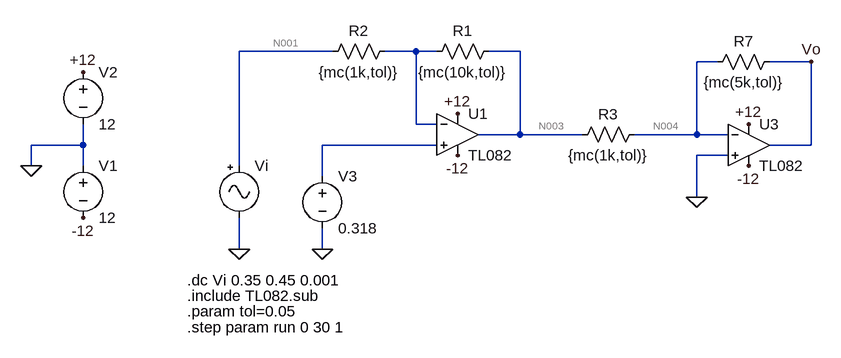
[diagram p0: schematic EJ_6_Aplicacion.asc]
EJ_6_Aplicacion.asc, the LTspice schematic file:
Version 4
SHEET 1 1368 740
WIRE 112 48 -32 48
WIRE 240 48 192 48
WIRE 272 48 240 48
WIRE 400 48 352 48
WIRE 704 64 672 64
WIRE 848 64 784 64
WIRE 240 160 240 48
WIRE 272 160 240 160
WIRE 400 176 400 48
WIRE 400 176 336 176
WIRE 496 176 400 176
WIRE 672 176 672 64
WIRE 672 176 576 176
WIRE 720 176 672 176
WIRE -272 192 -272 160
WIRE -272 192 -352 192
WIRE 272 192 96 192
WIRE 848 192 848 64
WIRE 848 192 784 192
WIRE 720 208 672 208
WIRE -352 224 -352 192
WIRE -272 224 -272 192
WIRE -32 224 -32 48
WIRE 96 240 96 192
WIRE 672 272 672 208
WIRE -32 352 -32 304
WIRE 96 352 96 320
FLAG -352 224 0
FLAG -272 80 +12
FLAG 304 144 +12
FLAG -272 304 -12
FLAG 304 208 -12
FLAG -32 352 0
FLAG 752 160 +12
FLAG 752 224 -12
FLAG 848 64 Vo
FLAG 96 352 0
FLAG 672 272 0
SYMBOL Opamps\\opamp2 304 112 R0
SYMATTR InstName U1
SYMATTR Value TL082
SYMBOL voltage -272 208 R0
WINDOW 123 0 0 Left 2
WINDOW 39 0 0 Left 2
SYMATTR InstName V1
SYMATTR Value 12
SYMBOL voltage -272 64 R0
WINDOW 123 0 0 Left 2
WINDOW 39 0 0 Left 2
SYMATTR InstName V2
SYMATTR Value 12
SYMBOL Misc\\signal -32 208 R0
WINDOW 123 0 0 Left 2
WINDOW 39 0 0 Left 2
SYMATTR InstName Vi
SYMATTR Value ""
SYMBOL res 368 32 R90
WINDOW 0 0 56 VBottom 2
WINDOW 3 32 56 VTop 2
SYMATTR InstName R1
SYMATTR Value {mc(10k,tol)}
SYMBOL Opamps\\opamp2 752 128 R0
SYMATTR InstName U3
SYMATTR Value TL082
SYMBOL res 800 48 R90
WINDOW 0 0 56 VBottom 2
WINDOW 3 32 56 VTop 2
SYMATTR InstName R7
SYMATTR Value {mc(5k,tol)}
SYMBOL res 208 32 R90
WINDOW 0 0 56 VBottom 2
WINDOW 3 32 56 VTop 2
SYMATTR InstName R2
SYMATTR Value {mc(1k,tol)}
SYMBOL res 592 160 R90
WINDOW 0 0 56 VBottom 2
WINDOW 3 32 56 VTop 2
SYMATTR InstName R3
SYMATTR Value {mc(1k,tol)}
SYMBOL voltage 96 224 R0
WINDOW 123 0 0 Left 2
WINDOW 39 0 0 Left 2
SYMATTR InstName V3
SYMATTR Value 0.318
TEXT -112 400 Left 2 !.dc Vi 0.35 0.45 0.001
TEXT -112 424 Left 2 !.include TL082.sub
TEXT -112 448 Left 2 !.param tol=0.05
TEXT -112 472 Left 2 !.step param run 0 30 1

The netlist it stands for:
* EJ_6_Aplicacion.asc
XU1 N005 N002 +12 -12 N003 TL082  ; pins In+ In- V+ V- OUT
V1 0 -12 12
V2 +12 0 12
Vi N001 0
R1 N003 N002 {mc(10k,tol)}
XU3 0 N004 +12 -12 Vo TL082  ; pins In+ In- V+ V- OUT
R7 Vo N004 {mc(5k,tol)}
R2 N002 N001 {mc(1k,tol)}
R3 N004 N003 {mc(1k,tol)}
V3 N005 0 0.318
.dc Vi 0.35 0.45 0.001
.include TL082.sub
.param tol=0.05
.step param run 0 30 1
.backanno
.end

* Results of the author's LTspice run, read from the files saved beside the schematic
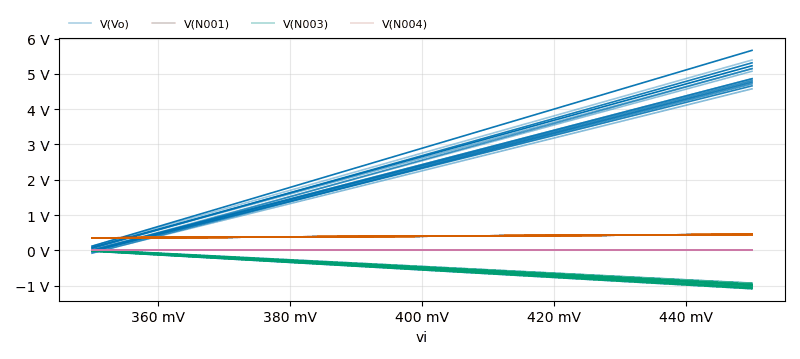
[diagram p1: DC transfer characteristic of EJ_6_Aplicacion.asc, plotted from the saved traces]
* DC transfer characteristic, 31 runs:
*   V(Vo) [run 1]: -21.24 mV at vi=350 mV, 4.763 V at vi=450 mV, min -21.24 mV, max 4.763 V
*   V(Vo) [run 2]: 115.9 mV at vi=350 mV, 5.393 V at vi=450 mV, min 115.9 mV, max 5.393 V
*   V(Vo) [run 3]: 680.2 µV at vi=350 mV, 5.073 V at vi=450 mV, min 680.2 µV, max 5.073 V
*   V(Vo) [run 4]: -72.02 mV at vi=350 mV, 4.576 V at vi=450 mV, min -72.02 mV, max 4.576 V
*   V(Vo) [run 5]: 73.93 mV at vi=350 mV, 5.148 V at vi=450 mV, min 73.93 mV, max 5.148 V
*   V(Vo) [run 6]: -2.247 mV at vi=350 mV, 4.864 V at vi=450 mV, min -2.247 mV, max 4.864 V
*   V(Vo) [run 7]: 21.39 mV at vi=350 mV, 4.752 V at vi=450 mV, min 21.39 mV, max 4.752 V
*   V(Vo) [run 8]: -81.12 mV at vi=350 mV, 4.777 V at vi=450 mV, min -81.12 mV, max 4.777 V
*   V(N001) [run 1]: 350 mV at vi=350 mV, 450 mV at vi=450 mV, min 350 mV, max 450 mV
*   V(N001) [run 2]: 350 mV at vi=350 mV, 450 mV at vi=450 mV, min 350 mV, max 450 mV
*   V(N001) [run 3]: 350 mV at vi=350 mV, 450 mV at vi=450 mV, min 350 mV, max 450 mV
*   V(N001) [run 4]: 350 mV at vi=350 mV, 450 mV at vi=450 mV, min 350 mV, max 450 mV
*   V(N001) [run 5]: 350 mV at vi=350 mV, 450 mV at vi=450 mV, min 350 mV, max 450 mV
*   V(N001) [run 6]: 350 mV at vi=350 mV, 450 mV at vi=450 mV, min 350 mV, max 450 mV
*   V(N001) [run 7]: 350 mV at vi=350 mV, 450 mV at vi=450 mV, min 350 mV, max 450 mV
*   V(N001) [run 8]: 350 mV at vi=350 mV, 450 mV at vi=450 mV, min 350 mV, max 450 mV
*   V(N003) [run 1]: 4.365 mV at vi=350 mV, -975.8 mV at vi=450 mV, min -975.8 mV, max 4.365 mV
*   V(N003) [run 2]: -23.43 mV at vi=350 mV, -1.09 V at vi=450 mV, min -1.09 V, max -23.43 mV
*   V(N003) [run 3]: -120.2 µV at vi=350 mV, -994.3 mV at vi=450 mV, min -994.3 mV, max -120.2 µV
*   V(N003) [run 4]: 14.7 mV at vi=350 mV, -933.1 mV at vi=450 mV, min -933.1 mV, max 14.7 mV
*   V(N003) [run 5]: -15.16 mV at vi=350 mV, -1.056 V at vi=450 mV, min -1.056 V, max -15.16 mV
*   V(N003) [run 6]: 471.4 µV at vi=350 mV, -991.8 mV at vi=450 mV, min -991.8 mV, max 471.4 µV
*   V(N003) [run 7]: -4.545 mV at vi=350 mV, -1.013 V at vi=450 mV, min -1.013 V, max -4.545 mV
*   V(N003) [run 8]: 15.78 mV at vi=350 mV, -928.7 mV at vi=450 mV, min -928.7 mV, max 15.78 mV
*   V(N004) [run 1]: 11.07 µV at vi=350 mV, -11.03 µV at vi=450 mV, min -11.03 µV, max 11.07 µV
*   V(N004) [run 2]: 10.44 µV at vi=350 mV, -13.92 µV at vi=450 mV, min -13.92 µV, max 10.44 µV
*   V(N004) [run 3]: 10.97 µV at vi=350 mV, -12.49 µV at vi=450 mV, min -12.49 µV, max 10.97 µV
*   V(N004) [run 4]: 11.3 µV at vi=350 mV, -10.19 µV at vi=450 mV, min -10.19 µV, max 11.3 µV
*   V(N004) [run 5]: 10.63 µV at vi=350 mV, -12.84 µV at vi=450 mV, min -12.84 µV, max 10.63 µV
*   V(N004) [run 6]: 10.98 µV at vi=350 mV, -11.48 µV at vi=450 mV, min -11.48 µV, max 10.98 µV
*   V(N004) [run 7]: 10.87 µV at vi=350 mV, -11.03 µV at vi=450 mV, min -11.03 µV, max 10.87 µV
*   V(N004) [run 8]: 11.35 µV at vi=350 mV, -11.13 µV at vi=450 mV, min -11.13 µV, max 11.35 µV